# Altium schematic sheet Minimal.SchDoc
size A4
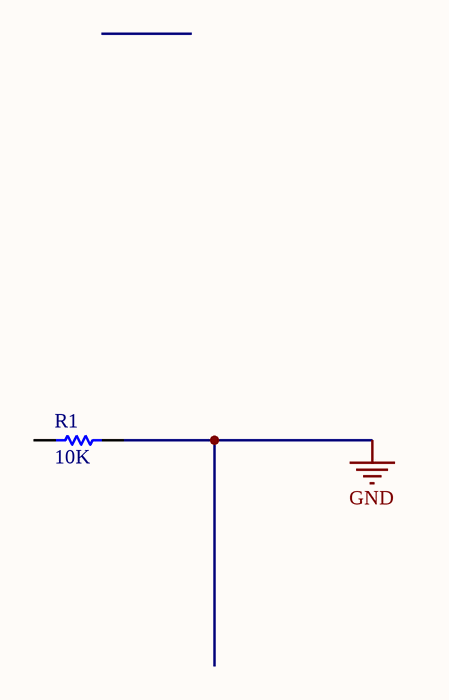
[diagram p0: Minimal.SchDoc]

## Parts
R1  value 10K  (hidden comment: Resistor)

## Nets
GND: R1.2

Not connected (* = marked no-connect by the designer): R1 1

## Library data of the parts
R1 = Resistor: TC1: 0; SimulationGenericComponent: True; TC2: 0